# Altium project Beagle93.PrjPCB (part 3 of 5)

## Sheet FPGAPower&Misc.SchDoc: =ProjectName
size 420 x 297 mm; Author: G.K.; CompanyName: WUT; DrawnBy: P.K.; Organization: WUT ISE; Address1: Warsaw Univeristy of Technology; Address2: Nowowiejska 15/19; DocumentNumber: 5; Revision: 1.1; SheetNumber: 5; SheetTotal: 12; EDA_Number: ARTIQ; Projet: ARTIQ/SINARA; ModifiedBy: -; CreateDate: XX/XX/XXXX; CheckedDate: -; Title2: FPGAPower&Misc.SchDoc; DivGrp: ISE; Designer: G.K. and P.K.; ModifiedDate: -; ProjectName: ARTIQ/SINARA
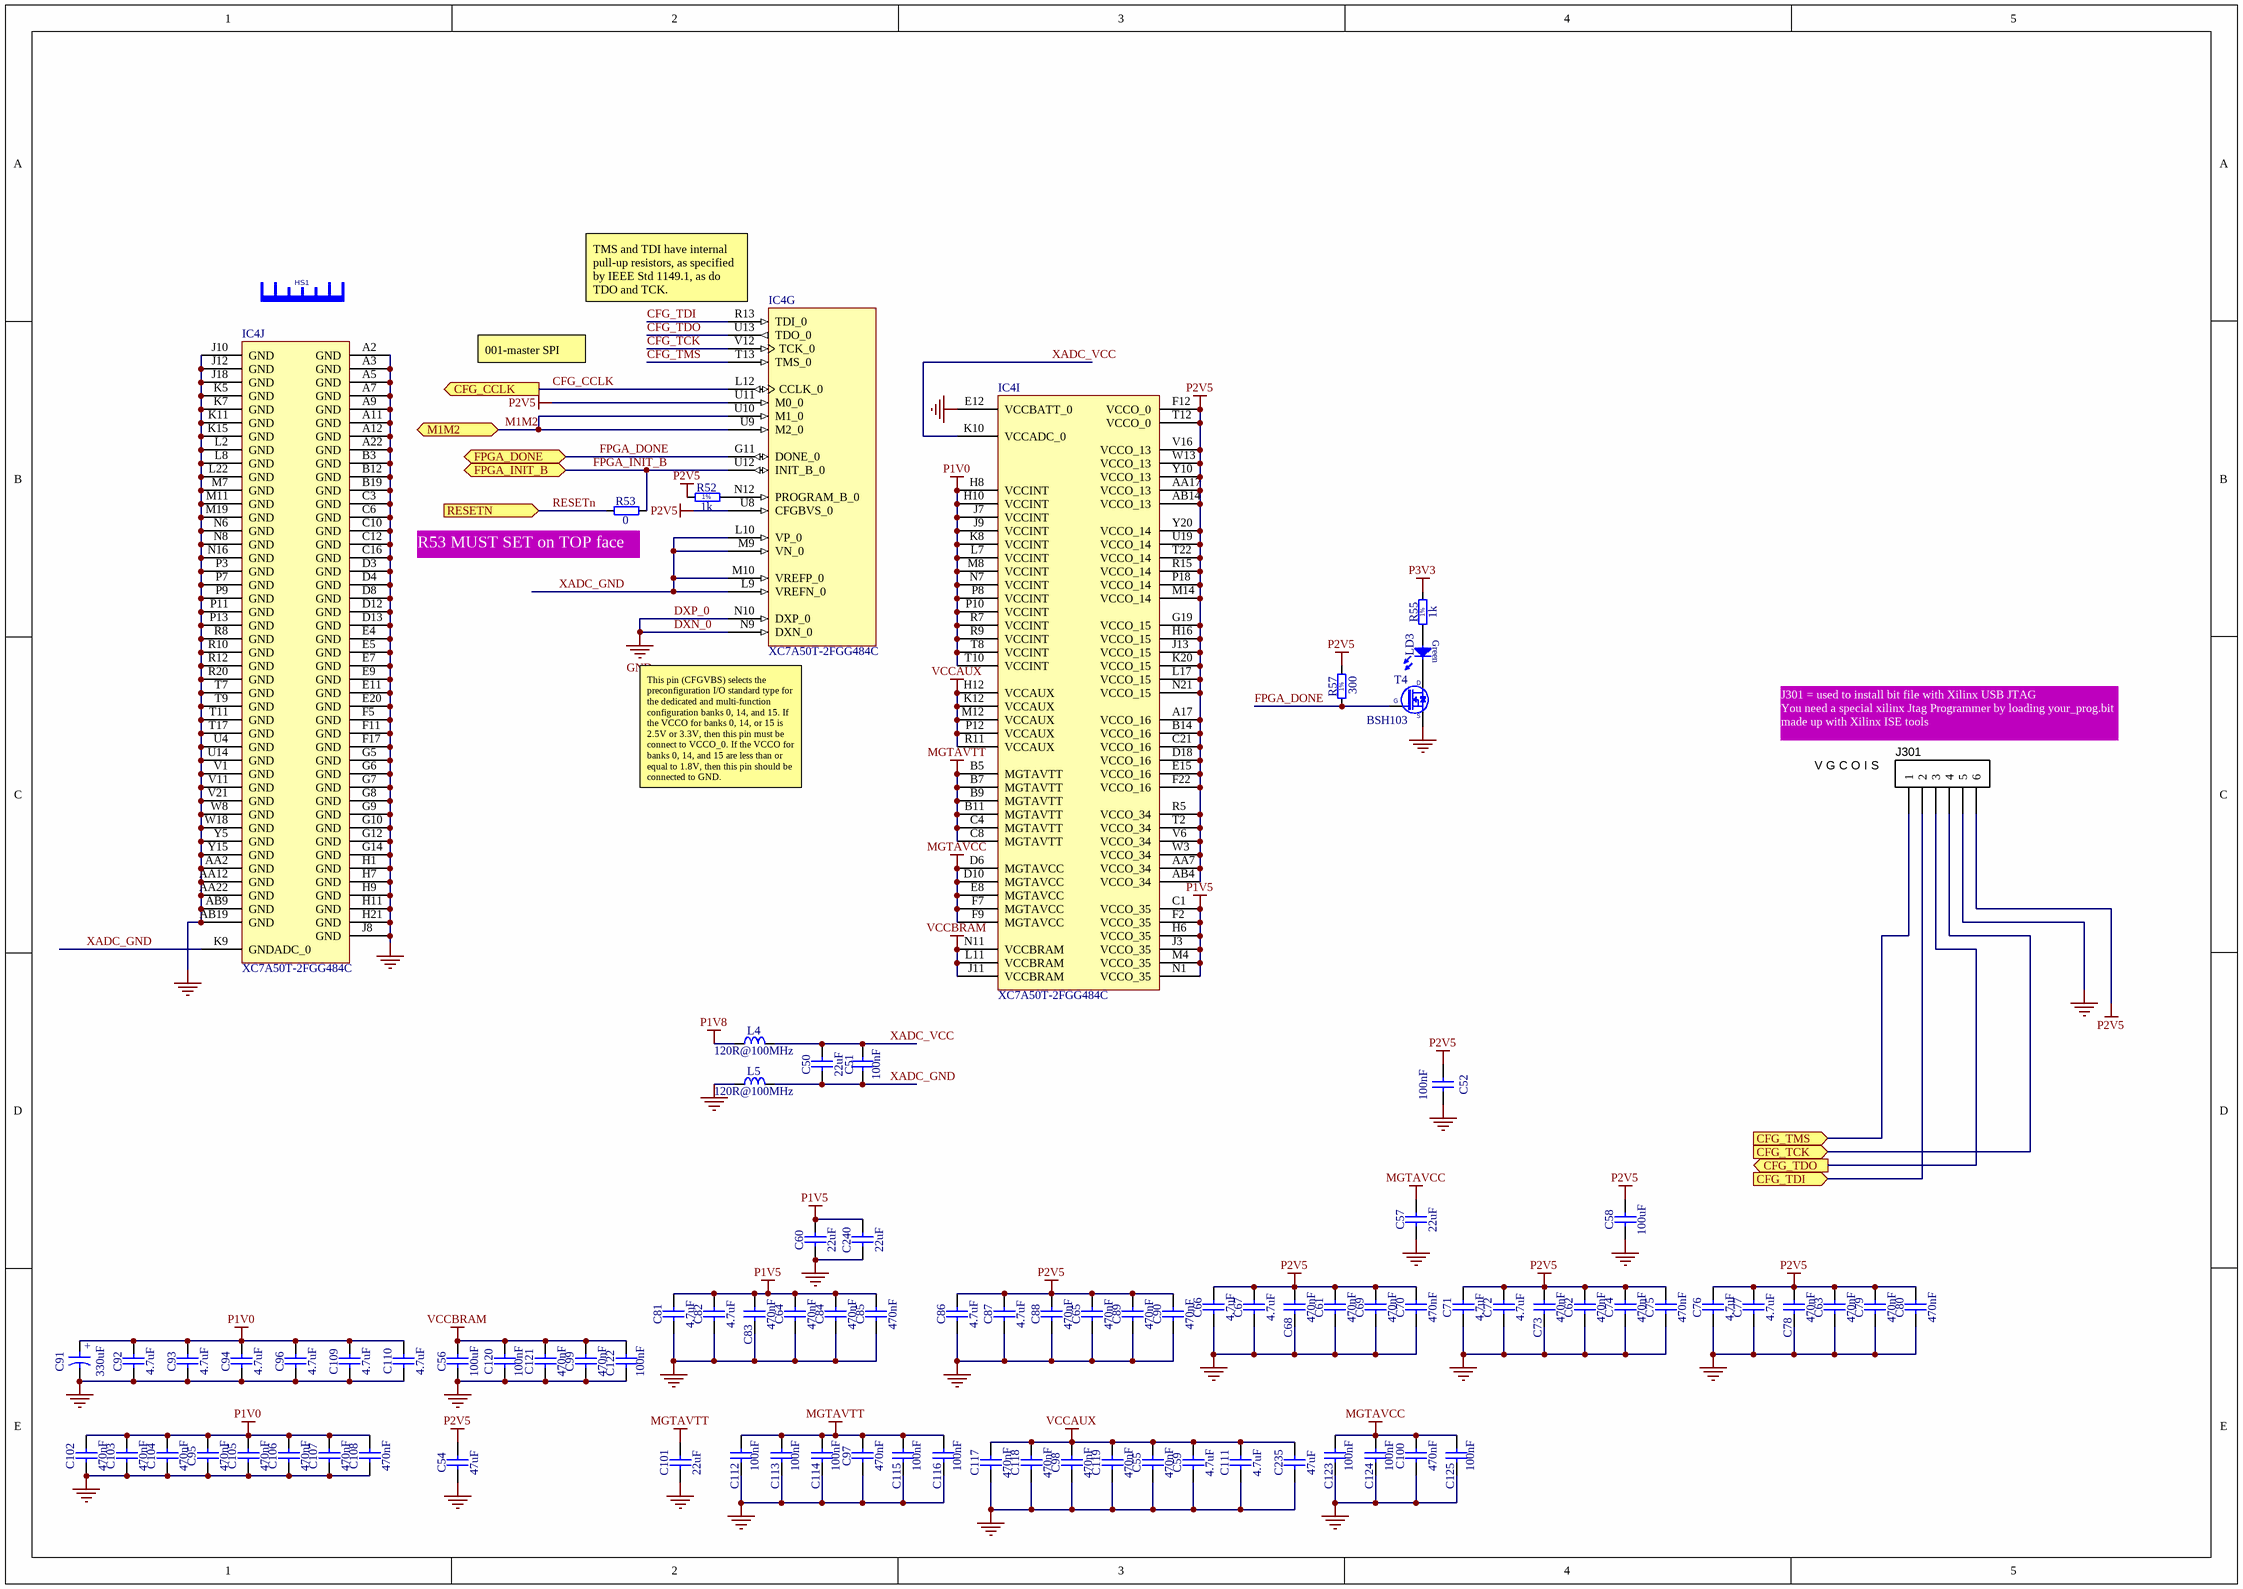
[diagram p3: FPGAPower&Misc.SchDoc]

### Parts
(Parts that share a designator on the sheet are numbered #1, #2 ... from top to bottom, then left to right.)
C50  22uF  [CAPC1709X100N]
C51  100nF  [CAPC0603X33N]
C52  100nF  [0603 Polar Cap]
C54  47uF  [CAPC3225X270N]
C55  470nF  [CAPC0603X33N]
C56  100uF  [CAPC3225X270N]
C57  22uF  [CAPC1709X100N]
C58  100uF  [CAPC3225X270N]
C59  4.7uF  [CAPC2012X135N]
C60  22uF  [CAPC1709X100N]
C61  470nF  [CAPC0603X33N]
C62  470nF  [CAPC0603X33N]
C63  470nF  [CAPC0603X33N]
C64  470nF  [CAPC0603X33N]
C65  470nF  [CAPC0603X33N]
C66  4.7uF  [CAPC2012X135N]
C67  4.7uF  [CAPC2012X135N]
C68  470nF  [CAPC0603X33N]
C69  470nF  [CAPC0603X33N]
C70  470nF  [CAPC0603X33N]
C71  4.7uF  [CAPC2012X135N]
C72  4.7uF  [CAPC2012X135N]
C73  470nF  [CAPC0603X33N]
C74  470nF  [CAPC0603X33N]
C75  470nF  [CAPC0603X33N]
C76  4.7uF  [CAPC2012X135N]
C77  4.7uF  [CAPC2012X135N]
C78  470nF  [CAPC0603X33N]
C79  470nF  [CAPC0603X33N]
C80  470nF  [CAPC0603X33N]
C81  4.7uF  [CAPC2012X135N]
C82  4.7uF  [CAPC2012X135N]
C83  470nF  [CAPC0603X33N]
C84  470nF  [CAPC0603X33N]
C85  470nF  [CAPC0603X33N]
C86  4.7uF  [CAPC2012X135N]
C87  4.7uF  [CAPC2012X135N]
C88  470nF  [CAPC0603X33N]
C89  470nF  [CAPC0603X33N]
C90  470nF  [CAPC0603X33N]
C91  330uF  [CAPMP7343X190N]
C92  4.7uF  [CAPC2012X135N]
C93  4.7uF  [CAPC2012X135N]
C94  4.7uF  [CAPC2012X135N]
C95  470nF  [CAPC0603X33N]
C96  4.7uF  [CAPC2012X135N]
C97  470nF  [CAPC0603X33N]
C98  470nF  [CAPC0603X33N]
C99  470nF  [CAPC0603X33N]
C100  470nF  [CAPC0603X33N]
C101  22uF  [CAPC1709X100N]
C102  470nF  [CAPC0603X33N]
C103  470nF  [CAPC0603X33N]
C104  470nF  [CAPC0603X33N]
C105  470nF  [CAPC0603X33N]
C106  470nF  [CAPC0603X33N]
C107  470nF  [CAPC0603X33N]
C108  470nF  [CAPC0603X33N]
C109  4.7uF  [CAPC2012X135N]
C110  4.7uF  [CAPC2012X135N]
C111  4.7uF  [CAPC2012X135N]
C112  100nF  [CAPC0603X33N]
C113  100nF  [CAPC0603X33N]
C114  100nF  [CAPC0603X33N]
C115  100nF  [CAPC0603X33N]
C116  100nF  [CAPC0603X33N]
C117  470nF  [CAPC0603X33N]
C118  470nF  [CAPC0603X33N]
C119  470nF  [CAPC0603X33N]
C120  100nF  [CAPC0603X33N]
C121  470nF  [CAPC0603X33N]
C122  100nF  [CAPC0603X33N]
C123  100nF  [CAPC0603X33N]
C124  100nF  [CAPC0603X33N]
C125  100nF  [CAPC0603X33N]
C235  47uF  [CAPC3225X270N]
C240  22uF  [CAPC1709X100N]
HS1  Heat Sink No Pad  [ICK BGA 23 x 23 x 10]  (value not drawn)
IC4#2  XC7A50T-2FGG484C  [FGG484]  (parts G,I,J of 10)
J301  V G C O I S  [HDR1X6]  (no BOM)
L4  120R@100MHz  [INDC1608X65N]
L5  120R@100MHz  [INDC1608X65N]
LD3  (no value)  [LED-0603-GREEN]
R52  1k  [RESC1005X40N]
R53  0  [RESC1005X40N]
R55  1k  [RESC1005X40N]
R57  300  [RESC1005X40N]
T4  BSH103  [SOT95P230X110-3N]

### Ports
CFG_CCLK (out), CFG_TCK (in), CFG_TDI (in), CFG_TDO (out), CFG_TMS (in), FPGA_DONE, FPGA_INIT_B, M1M2, RESETN (in)

### Nets
DXN_0: C52.1 C54.1 C55.1 C56.1 C57.1 C58.1 C59.1 C60.1 C61.1 C62.1 C63.1 C64.1 C65.1 C66.1 C67.1 C68.1 C69.1 C70.1 C71.1 C72.1 C73.1 C74.1 C75.1 C76.1 C77.1 C78.1 C79.1 C80.1 C81.1 C82.1 C83.1 C84.1 C85.1 C86.1 C87.1 C88.1 C89.1 C90.1 C91.2 C92.1 C93.1 C94.1 C95.1 C96.1 C97.1 C98.1 C99.1 C100.1 C101.1 C102.1 C103.1 C104.1 C105.1 C106.1 C107.1 C108.1 C109.1 C110.1 C111.1 C112.1 C113.1 C114.1 C115.1 C116.1 C117.1 C118.1 C119.1 C120.1 C121.1 C122.1 C123.1 C124.1 C125.1 C235.1 C240.1 IC4#2.A2(GND) IC4#2.A3(GND) IC4#2.A5(GND) IC4#2.A7(GND) IC4#2.A9(GND) IC4#2.A11(GND) IC4#2.A12(GND) IC4#2.A22(GND) IC4#2.AA2(GND) IC4#2.AA12(GND) IC4#2.AA22(GND) IC4#2.AB9(GND) IC4#2.AB19(GND) IC4#2.B3(GND) IC4#2.B12(GND) IC4#2.B19(GND) IC4#2.C3(GND) IC4#2.C6(GND) IC4#2.C10(GND) IC4#2.C12(GND) IC4#2.C16(GND) IC4#2.D3(GND) IC4#2.D4(GND) IC4#2.D8(GND) IC4#2.D12(GND) IC4#2.D13(GND) IC4#2.E4(GND) IC4#2.E5(GND) IC4#2.E7(GND) IC4#2.E9(GND) IC4#2.E11(GND) IC4#2.E12(VCCBATT_0) IC4#2.E20(GND) IC4#2.F5(GND) IC4#2.F11(GND) IC4#2.F17(GND) IC4#2.G5(GND) IC4#2.G6(GND) IC4#2.G7(GND) IC4#2.G8(GND) IC4#2.G9(GND) IC4#2.G10(GND) IC4#2.G12(GND) IC4#2.G14(GND) IC4#2.H1(GND) IC4#2.H7(GND) IC4#2.H9(GND) IC4#2.H11(GND) IC4#2.H21(GND) IC4#2.J8(GND) IC4#2.J10(GND) IC4#2.J12(GND) IC4#2.J18(GND) IC4#2.K5(GND) IC4#2.K7(GND) IC4#2.K11(GND) IC4#2.K15(GND) IC4#2.L2(GND) IC4#2.L8(GND) IC4#2.L22(GND) IC4#2.M7(GND) IC4#2.M11(GND) IC4#2.M19(GND) IC4#2.N6(GND) IC4#2.N8(GND) IC4#2.N9(DXN_0) IC4#2.N10(DXP_0) IC4#2.N16(GND) IC4#2.P3(GND) IC4#2.P7(GND) IC4#2.P9(GND) IC4#2.P11(GND) IC4#2.P13(GND) IC4#2.R8(GND) IC4#2.R10(GND) IC4#2.R12(GND) IC4#2.R20(GND) IC4#2.T7(GND) IC4#2.T9(GND) IC4#2.T11(GND) IC4#2.T17(GND) IC4#2.U4(GND) IC4#2.U14(GND) IC4#2.V1(GND) IC4#2.V11(GND) IC4#2.V21(GND) IC4#2.W8(GND) IC4#2.W18(GND) IC4#2.Y5(GND) IC4#2.Y15(GND) J301.5 L5.1 T4.2(S)  [also labelled DXP_0, GND]
MGTAVCC: C57.2 C100.2 C123.2 C124.2 C125.2 IC4#2.D6(MGTAVCC) IC4#2.D10(MGTAVCC) IC4#2.E8(MGTAVCC) IC4#2.F7(MGTAVCC) IC4#2.F9(MGTAVCC)
MGTAVTT: C97.2 C101.2 C112.2 C113.2 C114.2 C115.2 C116.2 IC4#2.B5(MGTAVTT) IC4#2.B7(MGTAVTT) IC4#2.B9(MGTAVTT) IC4#2.B11(MGTAVTT) IC4#2.C4(MGTAVTT) IC4#2.C8(MGTAVTT)
P1V0: C91.1 C92.2 C93.2 C94.2 C95.2 C96.2 C102.2 C103.2 C104.2 C105.2 C106.2 C107.2 C108.2 C109.2 C110.2 IC4#2.H8(VCCINT) IC4#2.H10(VCCINT) IC4#2.J7(VCCINT) IC4#2.J9(VCCINT) IC4#2.K8(VCCINT) IC4#2.L7(VCCINT) IC4#2.M8(VCCINT) IC4#2.N7(VCCINT) IC4#2.P8(VCCINT) IC4#2.P10(VCCINT) IC4#2.R7(VCCINT) IC4#2.R9(VCCINT) IC4#2.T8(VCCINT) IC4#2.T10(VCCINT)
P1V5: C60.2 C64.2 C81.2 C82.2 C83.2 C84.2 C85.2 C240.2 IC4#2.C1(VCCO_35) IC4#2.F2(VCCO_35) IC4#2.H6(VCCO_35) IC4#2.J3(VCCO_35) IC4#2.M4(VCCO_35) IC4#2.N1(VCCO_35)
P1V8: L4.1
P2V5: C52.2 C54.2 C58.2 C61.2 C62.2 C63.2 C65.2 C66.2 C67.2 C68.2 C69.2 C70.2 C71.2 C72.2 C73.2 C74.2 C75.2 C76.2 C77.2 C78.2 C79.2 C80.2 C86.2 C87.2 C88.2 C89.2 C90.2 IC4#2.A17(VCCO_16) IC4#2.AA7(VCCO_34) IC4#2.AA17(VCCO_13) IC4#2.AB4(VCCO_34) IC4#2.AB14(VCCO_13) IC4#2.B14(VCCO_16) IC4#2.C21(VCCO_16) IC4#2.D18(VCCO_16) IC4#2.E15(VCCO_16) IC4#2.F12(VCCO_0) IC4#2.F22(VCCO_16) IC4#2.G19(VCCO_15) IC4#2.H16(VCCO_15) IC4#2.J13(VCCO_15) IC4#2.K20(VCCO_15) IC4#2.L17(VCCO_15) IC4#2.M14(VCCO_14) IC4#2.N21(VCCO_15) IC4#2.P18(VCCO_14) IC4#2.R5(VCCO_34) IC4#2.R15(VCCO_14) IC4#2.T2(VCCO_34) IC4#2.T12(VCCO_0) IC4#2.T22(VCCO_14) IC4#2.U8(CFGBVS_0) IC4#2.U11(M0_0) IC4#2.U19(VCCO_14) IC4#2.V6(VCCO_34) IC4#2.V16(VCCO_13) IC4#2.W3(VCCO_34) IC4#2.W13(VCCO_13) IC4#2.Y10(VCCO_13) IC4#2.Y20(VCCO_14) J301.6 R52.1 R57.2
P3V3: R55.2  [project net VCC]
VCCAUX: C55.2 C59.2 C98.2 C111.2 C117.2 C118.2 C119.2 C235.2 IC4#2.H12(VCCAUX) IC4#2.K12(VCCAUX) IC4#2.M12(VCCAUX) IC4#2.P12(VCCAUX) IC4#2.R11(VCCAUX)
VCCBRAM: C56.2 C99.2 C120.2 C121.2 C122.2 IC4#2.J11(VCCBRAM) IC4#2.L11(VCCBRAM) IC4#2.N11(VCCBRAM)
CFG_CCLK: IC4#2.L12(CCLK_0) ; port CFG_CCLK
CFG_TCK: IC4#2.V12(TCK_0)
CFG_TDI: IC4#2.R13(TDI_0)
CFG_TDO: IC4#2.U13(TDO_0)
CFG_TMS: IC4#2.T13(TMS_0)
FPGA_DONE: IC4#2.G11(DONE_0) R57.1 T4.1(G) ; port FPGA_DONE
FPGA_INIT_B: IC4#2.U12(INIT_B_0) R53.2 ; port FPGA_INIT_B
M1M2: IC4#2.U9(M2_0) IC4#2.U10(M1_0) ; port M1M2
RESETn: R53.1 ; port RESETN
XADC_GND: C50.1 C51.1 IC4#2.K9(GNDADC_0) IC4#2.L9(VREFN_0) IC4#2.L10(VP_0) IC4#2.M9(VN_0) IC4#2.M10(VREFP_0) L5.2
XADC_VCC: C50.2 C51.2 IC4#2.K10(VCCADC_0) L4.2
NetIC4#2_N12: IC4#2.N12(PROGRAM_B_0) R52.2
NetJ301_1: J301.1 ; port CFG_TMS
NetJ301_2: J301.2 ; port CFG_TDI
NetJ301_3: J301.3 ; port CFG_TDO
NetJ301_4: J301.4 ; port CFG_TCK
NetLD3_1: LD3.1(A) R55.1
NetLD3_2: LD3.2(C) T4.3(D)

### Notes on the sheet
- (near IC4#2) TMS and TDI have internal pull-up resistors, as specified by IEEE Std 1149.1, as do TDO and TCK.
- 001-master SPI
- (near R53) R53 MUST SET on TOP face
- (near IC4#2) This pin (CFGVBS) selects the preconfiguration I/O standard type for the dedicated and multi-function configuration banks 0, 14, and 15. If the VCCO for banks 0, 14, or 15 is 2.5V or 3.3V, then this pin must be connect to VCCO_0. If the VCCO for banks 0, 14, and 15 are less than or equal to 1.8V, then this pin should be connected to GND.
- (near J301) J301 = used to install bit file with Xilinx USB JTAG
  You need a special xilinx Jtag Programmer by loading your_prog.bit
  made up with Xilinx ISE tools
- (in symbol CTE7343-19_330UF_2.5V_20%_LESR0025_KEMET_T520) +
- (in symbol KINGBRIGHT_KPTR-3216CGCK) Green
- (in symbol R0402_1K_1%_0.0625W_100PPM) 1%
- (in symbol R0402_1k_1%_0.0625W_100PPM) 1%
- (in symbol R0402_300R_1%_0.0625W_100PPM) 1%

### Library data of the parts
C50 C57 C60 C101 C240 = CC0603_22UF_6.3V_20%_X5R: Non-polarised capacitor; Part Description: SMD Multilayer Chip Ceramic Capacitor; Manufacturer: GENERIC; Manufacturer1 Part Number: C1608X5R0J226M080AC; Voltage: 6.3V; TC: X5R; Tolerance: ±20%; Part Number: CC0603_22UF_6.3V_20%_X5R; Component Kind: Standard; Component Type: Standard; Pin Count: 2; Value: 22uF; Status: None; Manufacturer Part Number: CC0603_22UF_6.3V_20%_X5R; Case: 0603; Mounted: Yes; Socket: No; SMD: Yes; Sense: No; Manufacturer1 Example: TDK; Manufacturer1 ComponentHeight: 1mm; HelpURL: \\cern.ch\dfs\Applications\Altium\Datasheets\CC0603_X5R_TDK_C.pdf; Author: CERN DEM JLC; CreateDate: 16.12.2013; LatestRevisionDate: 13.09.2016; ClassName: Artix
C51 C52 C112-C116 C120 C122-C125 = CC0201_100NF_6.3V_10%_X5R: Non-polarised capacitor; Part Description: SMD Multilayer Chip Ceramic Capacitor; Manufacturer: GENERIC; Manufacturer1 Part Number: 02016D104KAT2A; Voltage: 6.3V; TC: X5R; Tolerance: ±10%; Part Number: CC0201_100NF_6.3V_10%_X5R; Component Kind: Standard; Component Type: Standard; Pin Count: 2; Value: 100nF; Status: Not Recommended; Manufacturer Part Number: CC0201_100NF_6.3V_10%_X5R; Case: 0201; Mounted: Yes; Socket: No; SMD: Yes; Sense: No; Manufacturer1 Example: AVX; Manufacturer1 ComponentHeight: 0.33mm; HelpURL: \\cern.ch\dfs\Applications\Altium\Datasheets\CC0201_X5R_AVX.pdf; Author: CERN DEM JLC; CreateDate: 2007-12-03; LatestRevisionDate: 2007-12-03
  C51 C112-C116 C120 C122-C125: ClassName: Artix
  C52: Footprint: CAPC0603X33N; ClassName: FPGA_JTAG
C54 C235 = CC1210_47UF_10V_10%_X7R: Non-polarised capacitor; Part Description: SMD Multilayer Chip Ceramic Capacitor; Manufacturer: GENERIC; Manufacturer1 Part Number: GRM32ER71A476KE15; Voltage: 10V; TC: X7R; Tolerance: ±10%; Part Number: CC1210_47UF_10V_10%_X7R; Component Kind: Standard; Component Type: Standard; Pin Count: 2; Value: 47uF; Status: None; Manufacturer Part Number: CC1210_47UF_10V_10%_X7R; Case: 1210; Mounted: Yes; Socket: No; SMD: Yes; Sense: No; Manufacturer1 Example: MURATA; Manufacturer1 ComponentHeight: 2.7mm; HelpURL: \\cern.ch\dfs\Applications\Altium\Datasheets\CC1210_X7R_MURATA.pdf; Author: CERN DEM BC; CreateDate: 18.11.2015; LatestRevisionDate: 18.11.2015
C55 C61-C65 C68-C70 C73-C75 C78-C80 C83-C85 C88-C90 C95 C97-C100 C102-C108 C117-C119 C121 = CC0201_470NF_4V_20%_X5R: Non-polarised capacitor; Part Description: SMD Multilayer Chip Ceramic Capacitor; Manufacturer: GENERIC; Manufacturer1 Part Number: AMK063BJ474MP-F; Voltage: 4V; TC: X5R; Tolerance: ±20%; Part Number: CC0201_470NF_4V_20%_X5R; Component Kind: Standard; Component Type: Standard; Pin Count: 2; Value: 470nF; Status: Not Recommended; Manufacturer Part Number: CC0201_470NF_4V_20%_X5R; Case: 0201; Mounted: Yes; Socket: No; SMD: Yes; Sense: No; Manufacturer1 Example: TAIYO YUDEN; Manufacturer1 ComponentHeight: 0.33mm; HelpURL: \\cern.ch\dfs\Applications\Altium\Datasheets\CC0201_X5R_TAIYO-YUDEN_STANDARD-CLASS2.pdf; Author: CERN DEM JLC; CreateDate: 27.05.2010; LatestRevisionDate: 27.05.2010
  C61-C65 C95 C97-C100: ClassName: Artix
C56 C58 = CC1210_100UF_6.3V_20%_X5R: Non-polarised capacitor; Part Description: SMD Multilayer Chip Ceramic Capacitor; Manufacturer: GENERIC; Manufacturer1 Part Number: GRM32ER60J107ME20L; Voltage: 6.3V; TC: X5R; Tolerance: ±20%; Part Number: CC1210_100UF_6.3V_20%_X5R; Component Kind: Standard; Component Type: Standard; Pin Count: 2; Value: 100uF; Status: Preferred; Manufacturer Part Number: CC1210_100UF_6.3V_20%_X5R; Case: 1210; Mounted: Yes; Socket: No; SMD: Yes; Sense: No; Manufacturer1 Example: MURATA; Manufacturer1 ComponentHeight: 2.7mm; HelpURL: \\cern.ch\dfs\Applications\Altium\Datasheets\CC1210_X5R_MURATA.pdf; Author: CERN DEM JLC; CreateDate: 19.04.2010; LatestRevisionDate: 19.04.2010
C59 C66 C67 C71 C72 C76 C77 C81 C82 C86 C87 C92-C94 C96 C109-C111 = CC0805_4.7UF_10V_10%_X5R: Non-polarised capacitor; Manufacturer: GENERIC; Part Description: SMD Multilayer Chip Ceramic Capacitor; Manufacturer1 Part Number: 222224013672; Voltage: 10V; TC: X5R; Tolerance: ±10%; Part Number: CC0805_4.7UF_10V_10%_X5R; Component Kind: Standard; Component Type: Standard; Pin Count: 2; Value: 4.7uF; Status: Preferred; Manufacturer Part Number: CC0805_4.7UF_10V_10%_X5R; Case: 0805; Mounted: Yes; Socket: No; SMD: Yes; Sense: No; Manufacturer1 Example: PHYCOMP; Manufacturer1 ComponentHeight: 1.45mm; HelpURL: \\cern.ch\dfs\Applications\Altium\Datasheets\CC0805_X5R_PHYCOMP_HC.pdf; Author: CERN DEM JLC; CreateDate: 03.12.2007; LatestRevisionDate: 03.12.2007
C91 = CTE7343-19_330UF_2.5V_20%_LESR0025_KEMET_T520: Polarised capacitor; Part Description: Low ESR 0R025 Tantalum Chip Capacitor; Manufacturer: KEMET; Manufacturer Part Number: T520V337M2R5ATE025; Voltage: 2.5V; Tolerance: ±20%; Part Number: CTE7343-19_330UF_2.5V_20%_LESR0025_KEMET_T520; Component Kind: Standard; Component Type: Standard; Pin Count: 2; Value: 330uF; Status: None; Case: V; Mounted: Yes; Socket: No; SMD: Yes; Sense: No; ComponentHeight: 1.9mm; HelpURL: \\cern.ch\dfs\Applications\Altium\Datasheets\CTE-LESR_KEMET_T520.pdf; Author: CERN DEM MR; CreateDate: 23.03.2016; LatestRevisionDate: 23.03.2016
HS1 = Heat Sink No Pad: Heat Sink Without Pad; Manufacturer: Fischer Elektronik; Part Description: 23 x 23 x 10 mm, heatsink for IC design BGA and others; Manufacturer Part Number: ICK BGA 23 x 23 x 10; ComponentHeight: 10 mm; HelpURL: http://www.fischerelektronik.de/web_fischer/en_GB/heatsinks/B02/Heatsinks%20for%20BGAs/PR/ICKBGA23x23x10_/$productCard/parameters/datasheet.xhtml
IC4#2 = CMP-0364-00026-3: Artix-7 FPGA, 285 User I/Os, 4 GTP, 484-Ball BGA, Speed Grade 2, Commercial Grade, Pb-Free; Generic Part Number: XC7A100T; Manufacturer: Xilinx; Max User I/O: 300; Clock Mgmt Tiles (CMTs): 6; Logic Cells: 101440; Block RAM Blocks (36Kb): 135; Block RAM Blocks (18Kb): 270; Speed Grade: -2; CLBs (Slices): 15850; Block RAM Blocks (Max Kb): 4860; DSP48E1 Slices: 240; RoHS: Pb-Free; ComponentLink3URL: http://www.xilinx.com/support/documentation/data_sheets/ds181_Artix_7_Data_Sheet.pdf; NexusDeviceID: XC7A100T-2FGG484C; DatasheetVersion: v1.12; Mounting Technology: Surface Mount; PackageDescription: Wire-Bond Fine-Pitch BGA, Body 23 x 23 mm, 1.0 mm Pitch; PackageReference: FGG484; ComponentLink2Description: Package Specification; Code_JEDEC: MS-034-AAJ-1; ComponentLink2URL: http://www.xilinx.com/support/documentation/user_guides/ug475_7Series_Pkg_Pinout.pdf; ComponentLink3Description: DC and Switching Characteristics; ComponentLink4Description: Package File; ComponentLink4URL: http://www.xilinx.com/support/packagefiles/a7packages/xc7a100tfgg484pkg.txt; ComponentLink1URL: http://www.xilinx.com/support/documentation/data_sheets/ds180_7Series_Overview.pdf; PartNumber: XC7A100T-2FGG484C; ComponentLink5URL: http://www.xilinx.com/support/documentation/user_guides/ug475_7Series_Pkg_Pinout.pdf; PackageVersion: Rev 1.8; ComponentLink5Description: Packaging and Pinout; ComponentLink1Description: Datasheet; CLBs (Max Distributed RAM Kb): 1188; ClassName: Artix
J301 = Header6P: Header, 6-pin, FPGA_JTAG
L4 L5 = IND0603_MURATA_BLM18SG121TN1D: Inductor; Part Description: SMD EMIFIL Suppression Chip Ferrite Bead; Manufacturer: MURATA; Power: 3A; Resistance: 0.025R; Tolerance: ±25%; Part Number: IND0603_MURATA_BLM18SG121TN1D; Component Kind: Standard; Component Type: Standard; Pin Count: 2; Value: 120R@100MHz; Status: None; Manufacturer Part Number: BLM18SG121TN1D; Case: 0603; Mounted: Yes; Socket: No; SMD: Yes; Sense: No; ComponentHeight: 0.65mm; HelpURL: \\cern.ch\dfs\Applications\Altium\Datasheets\IND0603_MURATA_BLM18S.pdf; Author: CERN DEM JLC; CreateDate: 23.07.2014; LatestRevisionDate: 23.07.2014; ClassName: Artix
LD3 = KINGBRIGHT_KPTR-3216CGCK: LED Green 1A 2C; Manufacturer Part Number: KPH-1608CGCK; ComponentHeight: 0.65mm; HelpURL: http://datasheet.octopart.com/KPH-1608CGCK-Kingbright-datasheet-62316526.pdf; Package Description: SMT Green LED, Case 0603, Body L 1.6 x W 0.8mm H 0.65mm
R52 = R0402_1K_1%_0.0625W_100PPM: Resistor - 1%; Part Description: General Purpose Thick Film Chip Resistor; Manufacturer: GENERIC; Manufacturer1 Part Number: 232270671002L; TC: ±100ppm/°C; PressFit: No; Part Number: R0402_1K_1%_0.0625W_100PPM; Component Kind: Standard; Component Type: Standard; Pin Count: 2; Value: 1k; Status: Not Recommended; Power: 0.0625W; Tolerance: ±1%; Manufacturer Part Number: R0402_1K_1%_0.0625W_100PPM; Case: 0402; Mounted: Yes; Sense: No; Socket: No; SMD: Yes; Manufacturer1 Example: YAGEO PHYCOMP; Manufacturer1 ComponentHeight: 0.4mm; HelpURL: \\cern.ch\dfs\Applications\Altium\Datasheets\R0402_Phycomp_RC0402.pdf; Author: CERN DEM JLC; CreateDate: 03.12.2007; LatestRevisionDate: 17.10.2012; ClassName: Artix
R53 = R0402_0R_JUMPER: Resistor; Part Description: 1A (0.05R Max DC Resistance) Zero Ohm Jumper; Manufacturer: GENERIC; Manufacturer1 Part Number: 232270591001L; PressFit: No; Part Number: R0402_0R_JUMPER; Component Kind: Standard; Component Type: Standard; Pin Count: 2; Value: 0; Status: Not Recommended; Manufacturer Part Number: R0402_0R_JUMPER; Case: 0402; Mounted: Yes; Sense: No; Socket: No; SMD: Yes; Manufacturer1 Example: YAGEO PHYCOMP; Manufacturer1 ComponentHeight: 0.4mm; HelpURL: \\cern.ch\dfs\Applications\Altium\Datasheets\R0402_Phycomp_RC0402.pdf; Author: CERN DEM JLC; CreateDate: 03.12.2007; LatestRevisionDate: 17.10.2012; ClassName: Artix
R55 = R0402_1k_1%_0.0625W_100PPM: Resistor - 1%; Part Description: General Purpose Thick Film Chip Resistor; Manufacturer: GENERIC; Manufacturer1 Part Number: 232270671002L; TC: ±100ppm/°C; PressFit: No; Part Number: R0402_1K_1%_0.0625W_100PPM; Component Kind: Standard; Component Type: Standard; Pin Count: 2; Value: 1k; Status: Not Recommended; Power: 0.0625W; Tolerance: ±1%; Manufacturer Part Number: R0402_1K_1%_0.0625W_100PPM; Case: 0402; Mounted: Yes; Sense: No; Socket: No; SMD: Yes; Manufacturer1 Example: YAGEO PHYCOMP; Manufacturer1 ComponentHeight: 0.4mm; HelpURL: \\cern.ch\dfs\Applications\Altium\Datasheets\R0402_Phycomp_RC0402.pdf; Author: CERN DEM JLC; CreateDate: 03.12.2007; LatestRevisionDate: 17.10.2012; ClassName: Artix
R57 = R0402_300R_1%_0.0625W_100PPM: Resistor - 1%; Part Description: General Purpose Thick Film Chip Resistor; Manufacturer: GENERIC; Manufacturer1 Part Number: 232270673001L; TC: ±100ppm/°C; PressFit: No; Part Number: R0402_300R_1%_0.0625W_100PPM; Component Kind: Standard; Component Type: Standard; Pin Count: 2; Value: 300; Status: Not Recommended; Power: 0.0625W; Tolerance: ±1%; Manufacturer Part Number: R0402_300R_1%_0.0625W_100PPM; Case: 0402; Mounted: Yes; Sense: No; Socket: No; SMD: Yes; Manufacturer1 Example: YAGEO PHYCOMP; Manufacturer1 ComponentHeight: 0.4mm; HelpURL: \\cern.ch\dfs\Applications\Altium\Datasheets\R0402_Phycomp_RC0402.pdf; Author: CERN DEM JLC; CreateDate: 03.12.2007; LatestRevisionDate: 17.10.2012
T4 = BSH103: N-CHANNEL MOSFET WITH DIODE; Part Description: 30V 850mA N-Channel Enhancement Mode Field-Effect Transistor; Manufacturer: NEXPERIA; PressFit: No; Bonding: No; Part Number: BSH103; Component Kind: Standard; Component Type: Standard; Device: BSH103; PackageDescription: SOT23, 3 pin, Pitch 0.95mm - 1.3mm W X 2.9mm L X 1.1mm H, IPC Medium Density; Manufacturer Part Number: BSH103; Pin Count: 3; Case: SOT23-3; Mounted: Yes; Socket: No; SMD: Yes; Sense: No; ComponentHeight: 1.1mm; HelpURL: \\cern.ch\dfs\Applications\Altium\Datasheets\BSH103.pdf; Author: CERN DEM JLC; CreateDate: 16.03.2010; LatestRevisionDate: 20.06.2017; ClassName: Artix

## Sheet FPGA_SDRAM.SchDoc: =ProjectName
size 420 x 297 mm; Author: G.K.; CompanyName: WUT; DrawnBy: G.K. and P.K.; Organization: WUT ISE; Address1: Warsaw Univeristy of Technology; Address2: Nowowiejska 15/19; DocumentNumber: 8; Revision: 1.1; SheetNumber: 8; SheetTotal: 12; EDA_Number: ARTIQ; Projet: ARTIQ/SINARA; ModifiedBy: -; CreateDate: XX/XX/XXXX; CheckedDate: -; Title2: FPGA_SDRAM.SchDoc; DivGrp: ISE; Designer: G.K. and P.K.; ModifiedDate: -; ProjectName: ARTIQ/SINARA
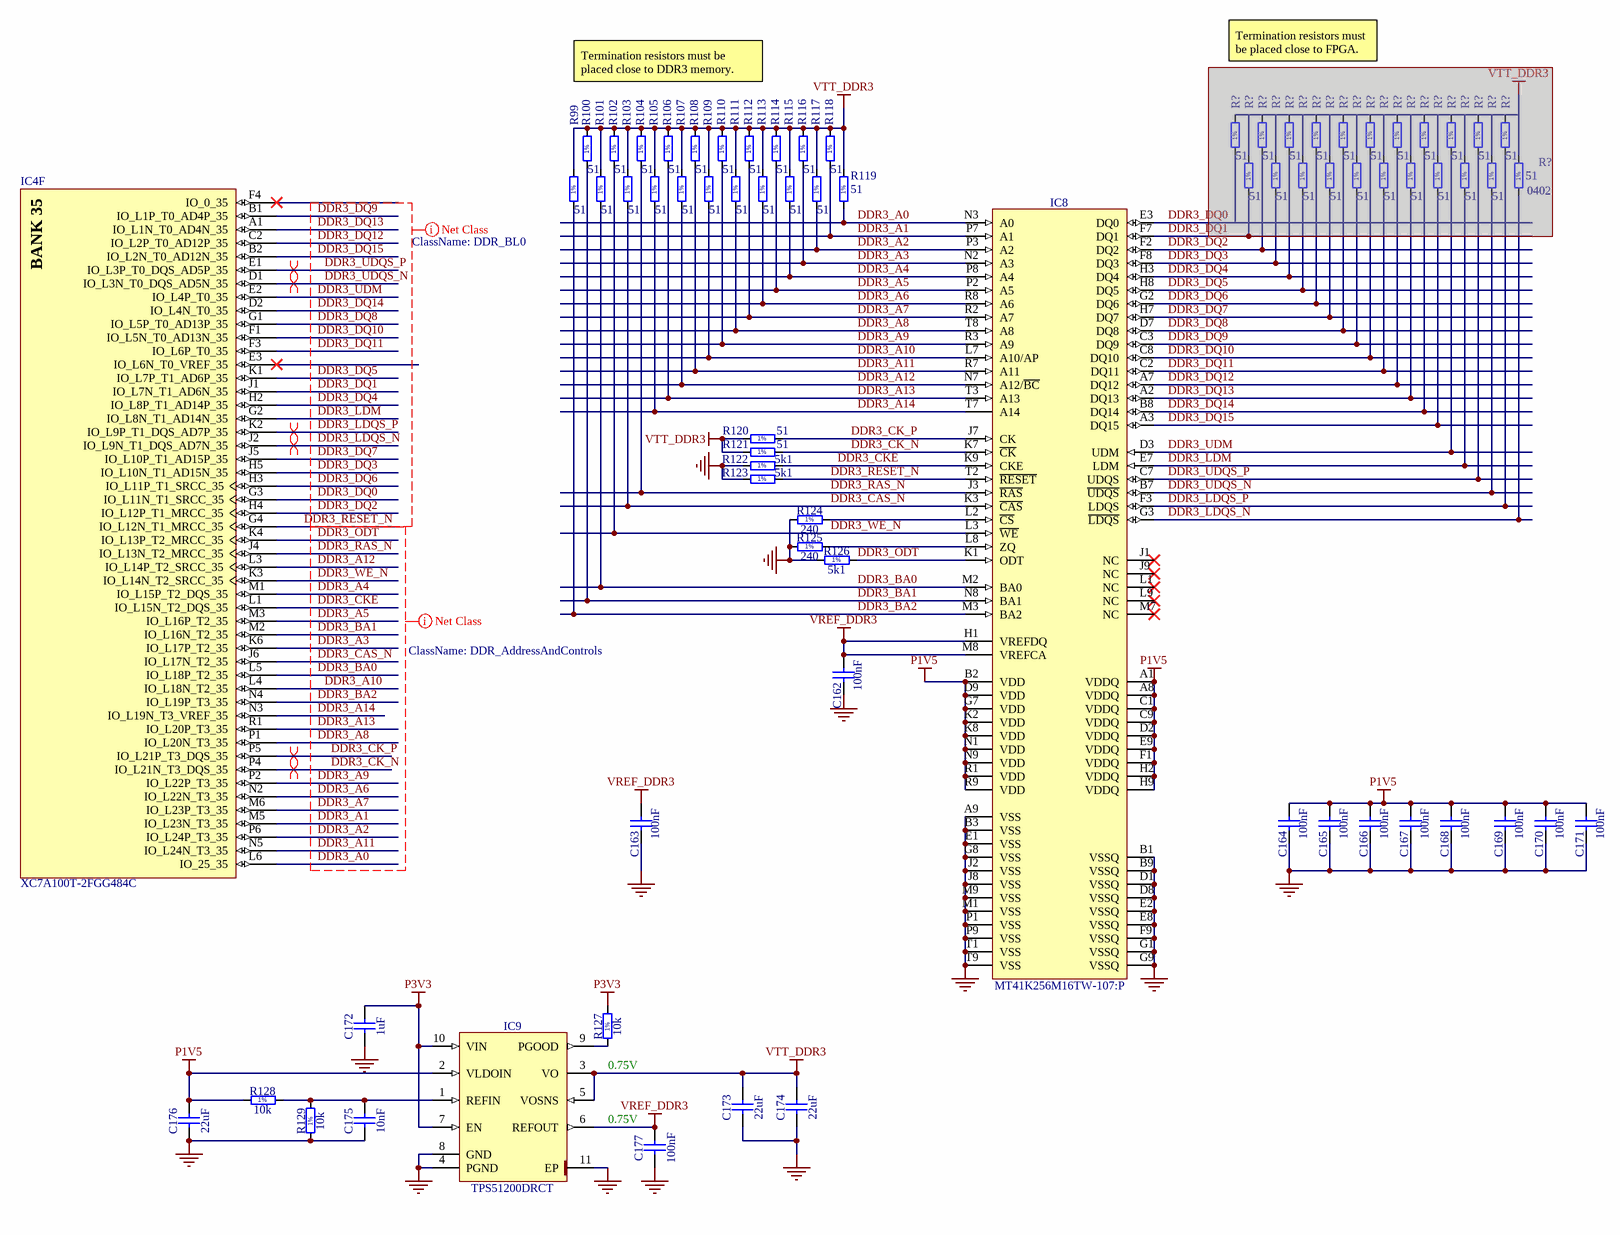
[diagram p4: FPGA_SDRAM.SchDoc]

### Parts
(Parts that share a designator on the sheet are numbered #1, #2 ... from top to bottom, then left to right.)
C162  100nF  [CAPC0603X33N]
C163  100nF  [CAPC0603X33N]
C164  100nF  [CAPC0603X33N]
C165  100nF  [CAPC0603X33N]
C166  100nF  [CAPC0603X33N]
C167  100nF  [CAPC0603X33N]
C168  100nF  [CAPC0603X33N]
C169  100nF  [CAPC0603X33N]
C170  100nF  [CAPC0603X33N]
C171  100nF  [CAPC0603X33N]
C172  1uF  [CAPC1005X55N]
C173  22uF  [CAPC1709X100N]
C174  22uF  [CAPC1709X100N]
C175  10nF  [CAPC1005X55N]
C176  22uF  [CAPC1709X100N]
C177  100nF  [CAPC0603X33N]
IC4#2  XC7A100T-2FGG484C  [FGG484]  (part F of 10)
IC8  MT41K256M16TW-107:P  [BGA96C80P9X16_800X1400X120]
IC9  TPS51200DRCT  [TEXAS_DRC (S-PVSON-N10)]
R99  51  [RESC1005X40N]
R100  51  [RESC1005X40N]
R101  51  [RESC1005X40N]
R102  51  [RESC1005X40N]
R103  51  [RESC1005X40N]
R104  51  [RESC1005X40N]
R105  51  [RESC1005X40N]
R106  51  [RESC1005X40N]
R107  51  [RESC1005X40N]
R108  51  [RESC1005X40N]
R109  51  [RESC1005X40N]
R110  51  [RESC1005X40N]
R111  51  [RESC1005X40N]
R112  51  [RESC1005X40N]
R113  51  [RESC1005X40N]
R114  51  [RESC1005X40N]
R115  51  [RESC1005X40N]
R116  51  [RESC1005X40N]
R117  51  [RESC1005X40N]
R118  51  [RESC1005X40N]
R119  51  [RESC1005X40N]
R120  51  [RESC1005X40N]
R121  51  [RESC1005X40N]
R122  5k1  [RESC1005X40N]
R123  5k1  [RESC1005X40N]
R124  240  [RESC1005X40N]
R125  240  [RESC1005X40N]
R126  5k1  [RESC1005X40N]
R127  10k  [RESC1005X40N]
R128  10k  [RESC1005X40N]
R129  10k  [RESC1005X40N]
R?#1  51  [RESC1005X40N]  (masked out: inside a compile mask, not in the netlist)
R?#2  51  [RESC1005X40N]  (masked out: inside a compile mask, not in the netlist)
R?#3  51  [RESC1005X40N]  (masked out: inside a compile mask, not in the netlist)
R?#4  51  [RESC1005X40N]  (masked out: inside a compile mask, not in the netlist)
R?#5  51  [RESC1005X40N]  (masked out: inside a compile mask, not in the netlist)
R?#6  51  [RESC1005X40N]  (masked out: inside a compile mask, not in the netlist)
R?#7  51  [RESC1005X40N]  (masked out: inside a compile mask, not in the netlist)
R?#8  51  [RESC1005X40N]  (masked out: inside a compile mask, not in the netlist)
R?#9  51  [RESC1005X40N]  (masked out: inside a compile mask, not in the netlist)
R?#10  51  [RESC1005X40N]  (masked out: inside a compile mask, not in the netlist)
R?#11  51  [RESC1005X40N]  (masked out: inside a compile mask, not in the netlist)
R?#12  51  [RESC1005X40N]  (masked out: inside a compile mask, not in the netlist)
R?#13  51  [RESC1005X40N]  (masked out: inside a compile mask, not in the netlist)
R?#14  51  [RESC1005X40N]  (masked out: inside a compile mask, not in the netlist)
R?#15  51  [RESC1005X40N]  (masked out: inside a compile mask, not in the netlist)
R?#16  51  [RESC1005X40N]  (masked out: inside a compile mask, not in the netlist)
R?#17  51  [RESC1005X40N]  (masked out: inside a compile mask, not in the netlist)
R?#18  51  [RESC1005X40N]  (masked out: inside a compile mask, not in the netlist)
R?#19  51  [RESC1005X40N]  (masked out: inside a compile mask, not in the netlist)
R?#20  51  [RESC1005X40N]  (masked out: inside a compile mask, not in the netlist)
R?#21  51  [RESC1005X40N]  (masked out: inside a compile mask, not in the netlist)
R?#22  51  Case: 0402  [RESC1005X40N]  (masked out: inside a compile mask, not in the netlist)

### Nets
GND: C162.1 C163.1 C164.1 C165.1 C166.1 C167.1 C168.1 C169.1 C170.1 C171.1 C172.1 C173.1 C174.1 C175.1 C176.1 C177.1 IC8.A9(VSS) IC8.B1(VSSQ) IC8.B3(VSS) IC8.B9(VSSQ) IC8.D1(VSSQ) IC8.D8(VSSQ) IC8.E1(VSS) IC8.E2(VSSQ) IC8.E8(VSSQ) IC8.F9(VSSQ) IC8.G1(VSSQ) IC8.G8(VSS) IC8.G9(VSSQ) IC8.J2(VSS) IC8.J8(VSS) IC8.M1(VSS) IC8.M9(VSS) IC8.P1(VSS) IC8.P9(VSS) IC8.T1(VSS) IC8.T9(VSS) IC9.4(PGND) IC9.8(GND) IC9.11(EP) R122.1 R123.1 R124.1 R125.1 R126.1 R129.1  [project net DXN_0]
P1V5: C164.2 C165.2 C166.2 C167.2 C168.2 C169.2 C170.2 C171.2 C176.2 IC8.A1(VDDQ) IC8.A8(VDDQ) IC8.B2(VDD) IC8.C1(VDDQ) IC8.C9(VDDQ) IC8.D2(VDDQ) IC8.D9(VDD) IC8.E9(VDDQ) IC8.F1(VDDQ) IC8.G7(VDD) IC8.H2(VDDQ) IC8.H9(VDDQ) IC8.K2(VDD) IC8.K8(VDD) IC8.N1(VDD) IC8.N9(VDD) IC8.R1(VDD) IC8.R9(VDD) IC9.2(VLDOIN) R128.1
P3V3: C172.2 IC9.7(EN) IC9.10(VIN) R127.2  [project net VCC]
VREF_DDR3: C162.2 C163.2 C177.2 IC8.H1(VREFDQ) IC8.M8(VREFCA) IC9.6(REFOUT)
VTT_DDR3: C173.2 C174.2 IC9.3(VO) IC9.5(VOSNS) R99.2 R100.2 R101.2 R102.2 R103.2 R104.2 R105.2 R106.2 R107.2 R108.2 R109.2 R110.2 R111.2 R112.2 R113.2 R114.2 R115.2 R116.2 R117.2 R118.2 R119.2 R120.1 R121.1
DDR3_A0: IC4#2.L6(IO_25_35) IC8.N3(A0) R119.1
DDR3_A1: IC4#2.M5(IO_L23N_T3_35) IC8.P7(A1) R118.1
DDR3_A2: IC4#2.P6(IO_L24P_T3_35) IC8.P3(A2) R117.1
DDR3_A3: IC4#2.K6(IO_L17P_T2_35) IC8.N2(A3) R116.1
DDR3_A4: IC4#2.M1(IO_L15P_T2_DQS_35) IC8.P8(A4) R115.1
DDR3_A5: IC4#2.M3(IO_L16P_T2_35) IC8.P2(A5) R114.1
DDR3_A6: IC4#2.N2(IO_L22N_T3_35) IC8.R8(A6) R113.1
DDR3_A7: IC4#2.M6(IO_L23P_T3_35) IC8.R2(A7) R112.1
DDR3_A8: IC4#2.P1(IO_L20N_T3_35) IC8.T8(A8) R111.1
DDR3_A9: IC4#2.P2(IO_L22P_T3_35) IC8.R3(A9) R110.1
DDR3_A10: IC4#2.L4(IO_L18N_T2_35) IC8.L7(A10/AP) R109.1
DDR3_A11: IC4#2.N5(IO_L24N_T3_35) IC8.R7(A11) R108.1
DDR3_A12: IC4#2.L3(IO_L14P_T2_SRCC_35) IC8.N7(A12/~{BC}) R107.1
DDR3_A13: IC4#2.R1(IO_L20P_T3_35) IC8.T3(A13) R106.1
DDR3_A14: IC4#2.N3(IO_L19N_T3_VREF_35) IC8.T7(A14) R105.1
DDR3_BA0: IC4#2.L5(IO_L18P_T2_35) IC8.M2(BA0) R101.1
DDR3_BA1: IC4#2.M2(IO_L16N_T2_35) IC8.N8(BA1) R100.1
DDR3_BA2: IC4#2.N4(IO_L19P_T3_35) IC8.M3(BA2) R99.1
DDR3_CAS_N: IC4#2.J6(IO_L17N_T2_35) IC8.K3(~{CAS}) R103.1
DDR3_CK_N: IC4#2.P4(IO_L21N_T3_DQS_35) IC8.K7(~{CK}) R121.2
DDR3_CK_P: IC4#2.P5(IO_L21P_T3_DQS_35) IC8.J7(CK) R120.2
DDR3_CKE: IC4#2.L1(IO_L15N_T2_DQS_35) IC8.K9(CKE) R122.2
DDR3_DQ0: IC4#2.G3(IO_L11N_T1_SRCC_35) IC8.E3(DQ0)
DDR3_DQ1: IC4#2.J1(IO_L7N_T1_AD6N_35) IC8.F7(DQ1)
DDR3_DQ2: IC4#2.H4(IO_L12P_T1_MRCC_35) IC8.F2(DQ2)
DDR3_DQ3: IC4#2.H5(IO_L10N_T1_AD15N_35) IC8.F8(DQ3)
DDR3_DQ4: IC4#2.H2(IO_L8P_T1_AD14P_35) IC8.H3(DQ4)
DDR3_DQ5: IC4#2.K1(IO_L7P_T1_AD6P_35) IC8.H8(DQ5)
DDR3_DQ6: IC4#2.H3(IO_L11P_T1_SRCC_35) IC8.G2(DQ6)
DDR3_DQ7: IC4#2.J5(IO_L10P_T1_AD15P_35) IC8.H7(DQ7)
DDR3_DQ8: IC4#2.G1(IO_L5P_T0_AD13P_35) IC8.D7(DQ8)
DDR3_DQ9: IC4#2.B1(IO_L1P_T0_AD4P_35) IC8.C3(DQ9)
DDR3_DQ10: IC4#2.F1(IO_L5N_T0_AD13N_35) IC8.C8(DQ10)
DDR3_DQ11: IC4#2.F3(IO_L6P_T0_35) IC8.C2(DQ11)
DDR3_DQ12: IC4#2.C2(IO_L2P_T0_AD12P_35) IC8.A7(DQ12)
DDR3_DQ13: IC4#2.A1(IO_L1N_T0_AD4N_35) IC8.A2(DQ13)
DDR3_DQ14: IC4#2.D2(IO_L4N_T0_35) IC8.B8(DQ14)
DDR3_DQ15: IC4#2.B2(IO_L2N_T0_AD12N_35) IC8.A3(DQ15)
DDR3_LDM: IC4#2.G2(IO_L8N_T1_AD14N_35) IC8.E7(LDM)
DDR3_LDQS_N: IC4#2.J2(IO_L9N_T1_DQS_AD7N_35) IC8.G3(~{LDQS})
DDR3_LDQS_P: IC4#2.K2(IO_L9P_T1_DQS_AD7P_35) IC8.F3(LDQS)
DDR3_ODT: IC4#2.K4(IO_L13P_T2_MRCC_35) IC8.K1(ODT) R126.2
DDR3_RAS_N: IC4#2.J4(IO_L13N_T2_MRCC_35) IC8.J3(~{RAS}) R104.1
DDR3_RESET_N: IC4#2.G4(IO_L12N_T1_MRCC_35) IC8.T2(~{RESET}) R123.2
DDR3_UDM: IC4#2.E2(IO_L4P_T0_35) IC8.D3(UDM)
DDR3_UDQS_N: IC4#2.D1(IO_L3N_T0_DQS_AD5N_35) IC8.B7(~{UDQS})
DDR3_UDQS_P: IC4#2.E1(IO_L3P_T0_DQS_AD5P_35) IC8.C7(UDQS)
DDR3_WE_N: IC4#2.K3(IO_L14N_T2_SRCC_35) IC8.L3(~{WE}) R102.1
NetC175_2: C175.2 IC9.1(REFIN) R128.2 R129.2
NetIC8_L2: IC8.L2(~{CS}) R124.2
NetIC8_L8: IC8.L8(ZQ) R125.2
NetIC9_9: IC9.9(PGOOD) R127.1

Not connected (* = marked no-connect by the designer): IC4#2 E3(IO_L6N_T0_VREF_35)* F4(IO_0_35)*; IC8 J1(NC)* J9(NC)* L1(NC)* L9(NC)* M7(NC)*

### Layout directives
differential pair: DDR3_CK_N, DDR3_CK_P, DDR3_LDQS_N, DDR3_LDQS_P, DDR3_UDQS_N, DDR3_UDQS_P
net class DDR_AddressAndControls; net class 50Ohm: DDR3_A0, DDR3_A1, DDR3_A2, DDR3_A3, DDR3_A4, DDR3_A5, DDR3_A6, DDR3_A7, DDR3_A8, DDR3_A9, DDR3_A10, DDR3_A11, DDR3_A12, DDR3_A13, DDR3_A14, DDR3_BA0, DDR3_BA1, DDR3_BA2, DDR3_CAS_N, DDR3_CK_N, DDR3_CK_P, DDR3_CKE, DDR3_ODT, DDR3_RAS_N, DDR3_WE_N
net class DDR_BL0; net class 50Ohm: DDR3_DQ0, DDR3_DQ1, DDR3_DQ2, DDR3_DQ3, DDR3_DQ4, DDR3_DQ5, DDR3_DQ6, DDR3_DQ7, DDR3_DQ8, DDR3_DQ9, DDR3_DQ10, DDR3_DQ11, DDR3_DQ12, DDR3_DQ13, DDR3_DQ14, DDR3_DQ15, DDR3_LDM, DDR3_LDQS_N, DDR3_LDQS_P, DDR3_UDM, DDR3_UDQS_N, DDR3_UDQS_P

### Notes on the sheet
- Termination resistors must be placed close to FPGA.
- Termination resistors must be placed close to DDR3 memory.
- (near R127) 0.75V
- (near C177) 0.75V
- (in symbol CMP-0364-00026-3, part F) BANK 35
- (in symbol R0402_5K1_1%_0.0625W_100PPM) 1%
- (in symbol R0402_10K_1%_0.0625W_100PPM) 1%
- (in symbol R0402_51R_1%_0.0625W_100PPM) 1%
- (in symbol R0402_240R_1%_0.0625W_100PPM) 1%

### Library data of the parts
C162-C171 C177 = CC0201_100NF_6.3V_10%_X5R: as C51 on sheet FPGAPower&Misc; Part Number: CC0201_100NF_6.3V_10%_X5R; Component Kind: Standard; Component Type: Standard; Pin Count: 2; Value: 100nF; Status: Not Recommended; Manufacturer Part Number: CC0201_100NF_6.3V_10%_X5R; Case: 0201; Mounted: Yes; Socket: No; SMD: Yes; Sense: No; Manufacturer1 Example: AVX; Manufacturer1 ComponentHeight: 0.33mm; HelpURL: \\cern.ch\dfs\Applications\Altium\Datasheets\CC0201_X5R_AVX.pdf; Author: CERN DEM JLC
  C162-C171: CreateDate: 2007-12-03; LatestRevisionDate: 2007-12-03
  C177: CreateDate: 03.12.2007; LatestRevisionDate: 03.12.2007
C172 = CC0402_1UF_16V_10%_X5R: Non-polarised capacitor; Part Description: SMD Multilayer Chip Ceramic Capacitor; Manufacturer: GENERIC; Manufacturer1 Part Number: C1005X5R1C105KT; Voltage: 16V; TC: X5R; Tolerance: ±10%; Part Number: CC0402_1UF_16V_10%_X5R; Component Kind: Standard; Component Type: Standard; Pin Count: 2; Value: 1uF; Status: Preferred; Manufacturer Part Number: CC0402_1UF_16V_10%_X5R; Case: 0402; Mounted: Yes; Socket: No; SMD: Yes; Manufacturer1 Example: TDK; Manufacturer1 ComponentHeight: 0.55mm; HelpURL: \\cern.ch\dfs\Applications\Altium\Datasheets\CC0402_X5R_TDK_C.pdf; Author: CERN DEM JLC; CreateDate: 25.10.2012; LatestRevisionDate: 25.10.2012; Sense: No
C173 C174 C176 = CC0603_22UF_6.3V_20%_X5R: as C50 on sheet FPGAPower&Misc; Part Number: CC0603_22UF_6.3V_20%_X5R; Component Kind: Standard; Component Type: Standard; Pin Count: 2; Value: 22uF; Status: None; Manufacturer Part Number: CC0603_22UF_6.3V_20%_X5R; Case: 0603; Mounted: Yes; Socket: No; SMD: Yes; Manufacturer1 Example: TDK; Manufacturer1 ComponentHeight: 1mm; HelpURL: \\cern.ch\dfs\Applications\Altium\Datasheets\CC0603_X5R_TDK_C.pdf; Author: CERN DEM JLC; CreateDate: 16.12.2013; LatestRevisionDate: 13.09.2016; Sense: No
C175 = CC0402_10NF_16V_10%_X7R: Non-polarised capacitor; Part Description: SMD Multilayer Chip Ceramic Capacitor; Manufacturer: GENERIC; Manufacturer1 Part Number: 223878715636; Voltage: 16V; TC: X7R; Tolerance: ±10%; Part Number: CC0402_10NF_16V_10%_X7R; Component Kind: Standard; Component Type: Standard; Pin Count: 2; Value: 10nF; Status: Not Recommended; Manufacturer Part Number: CC0402_10NF_16V_10%_X7R; Case: 0402; Mounted: Yes; Socket: No; SMD: Yes; Manufacturer1 Example: PHYCOMP; Manufacturer1 ComponentHeight: 0.55mm; HelpURL: \\cern.ch\dfs\Applications\Altium\Datasheets\CC0402_X7R_PHYCOMP.pdf; Author: CERN DEM JLC; CreateDate: 03.12.2007; LatestRevisionDate: 03.12.2007; Sense: No
IC4#2 = CMP-0364-00026-3: Artix-7 FPGA, 285 User I/Os, 4 GTP, 484-Ball BGA, Speed Grade 2, Commercial Grade, Pb-Free; Manufacturer: Xilinx; Max User I/O: 300; Clock Mgmt Tiles (CMTs): 6; Logic Cells: 101440; Block RAM Blocks (36Kb): 135; Block RAM Blocks (18Kb): 270; Speed Grade: -2; CLBs (Slices): 15850; Block RAM Blocks (Max Kb): 4860; DSP48E1 Slices: 240; RoHS: Pb-Free; ComponentLink3URL: http://www.xilinx.com/support/documentation/data_sheets/ds181_Artix_7_Data_Sheet.pdf; NexusDeviceID: XC7A100T-2FGG484C; DatasheetVersion: v1.12; Mounting Technology: Surface Mount; PackageDescription: Wire-Bond Fine-Pitch BGA, Body 23 x 23 mm, 1.0 mm Pitch; PackageReference: FGG484; ComponentLink2Description: Package Specification; Code_JEDEC: MS-034-AAJ-1; ComponentLink2URL: http://www.xilinx.com/support/documentation/user_guides/ug475_7Series_Pkg_Pinout.pdf; ComponentLink3Description: DC and Switching Characteristics; Generic Part Number: XC7A100T; ComponentLink4Description: Package File; ComponentLink4URL: http://www.xilinx.com/support/packagefiles/a7packages/xc7a100tfgg484pkg.txt; ComponentLink1URL: http://www.xilinx.com/support/documentation/data_sheets/ds180_7Series_Overview.pdf; PartNumber: XC7A100T-2FGG484C; ComponentLink5URL: http://www.xilinx.com/support/documentation/user_guides/ug475_7Series_Pkg_Pinout.pdf; PackageVersion: Rev 1.8; ComponentLink5Description: Packaging and Pinout; ComponentLink1Description: Datasheet; CLBs (Max Distributed RAM Kb): 1188; ClassName: Artix
IC8 = MT41K256M16TW-107:P: 32 Meg x 16 x 8 Banks DDR3L SDRAM; Part Description: +1.5V, 4Gb (32Meg x 16 x 8 banks) DDR3L SDRAM; Manufacturer: MICRON TECHNOLOGY; PressFit: No; Bonding: No; Part Number: MT41K256M16TW-107:P; Component Kind: Standard; Component Type: Standard; Device: MT41K256M16TW-107:P; PackageDescription: BGA 0.8mm, Pitch, Square 96 Pin, 9 Columns x 16 Rows, Body 14mm X 8mm X 1.2mm H; Manufacturer Part Number: MT41K256M16TW-107:P; Pin Count: 96; Case: BGA96; Mounted: Yes; Socket: No; SMD: Yes; Sense: No; ComponentHeight: 1.2mm; HelpURL: \\cern.ch\dfs\Applications\Altium\Datasheets\MT41K256M16TW-107-P.pdf; Author: CERN DEM MR; CreateDate: 2015-12-14; LatestRevisionDate: 2015-12-14
IC9 = TPS51200DRCT: Sink/Source DDR Termination Regulator; Part Description: 3.3V Sink/Source DDR Termination Regulator; Manufacturer: TEXAS INSTRUMENTS; PressFit: No; Bonding: No; Part Number: TPS51200DRCT; Component Kind: Standard; Component Type: Standard; Device: TPS51200DRCT; PackageDescription: SON, 0.50mm Pitch, 10-pin, 3.00mm W  X 3.00mm L X 1.00mm Height, (w/thermal tab 1.75 X 2.50 mm); Manufacturer Part Number: TPS51200DRCT; Pin Count: 11; Case: SON10; Mounted: Yes; Socket: No; SMD: Yes; Sense: No; ComponentHeight: 1mm; HelpURL: \\cern.ch\dfs\Applications\Altium\Datasheets\TPS51200DRCT.pdf; Author: CERN DEM JLC; CreateDate: 03.02.2010; LatestRevisionDate: 06.11.2013
R99-R121 R?#1-R?#22 = R0402_51R_1%_0.0625W_100PPM: Resistor - 1%; Part Description: General Purpose Thick Film Chip Resistor; Manufacturer: GENERIC; Manufacturer1 Part Number: 232270675109; TC: ±100ppm/°C; Table: Resistors SMD; Part Number: R0402_51R_1%_0.0625W_100PPM; Component Kind: Standard; Component Type: Standard; Pin Count: 2; Value: 51; Status: Not recommended; Power: 0.0625W; Tolerance: ±1%; Manufacturer Part Number: R0402_51R_1%_0.0625W_100PPM; Mounted: Yes; Socket: No; SMD: Yes; Manufacturer1 Example: PHYCOMP; Manufacturer1 ComponentHeight: 0.4mm; HelpURL: \\cern.ch\dfs\Applications\Altium\Datasheets\R0402_Phycomp_RC0402.pdf; Author: CERN DEM JLC; CreateDate: 03/12/2007; LatestRevisionDate: 13/03/2008
  R99-R118 R120 R121 R?#1-R?#21: Case: 0402
R122 R123 R126 = R0402_5K1_1%_0.0625W_100PPM: Resistor - 1%; Part Description: General Purpose Thick Film Chip Resistor; Manufacturer: GENERIC; Manufacturer1 Part Number: 232270675102L; TC: ±100ppm/°C; PressFit: No; Part Number: R0402_5K1_1%_0.0625W_100PPM; Component Kind: Standard; Component Type: Standard; Pin Count: 2; Value: 5k1; Status: Not Recommended; Power: 0.0625W; Tolerance: ±1%; Manufacturer Part Number: R0402_5K1_1%_0.0625W_100PPM; Case: 0402; Mounted: Yes; Sense: No; Socket: No; SMD: Yes; Manufacturer1 Example: YAGEO PHYCOMP; Manufacturer1 ComponentHeight: 0.4mm; HelpURL: \\cern.ch\dfs\Applications\Altium\Datasheets\R0402_Phycomp_RC0402.pdf; Author: CERN DEM JLC; CreateDate: 03.12.2007; LatestRevisionDate: 17.10.2012
R124 R125 = R0402_240R_1%_0.0625W_100PPM: Resistor - 1%; Part Description: General Purpose Thick Film Chip Resistor; Manufacturer: GENERIC; Manufacturer1 Part Number: 232270672401L; TC: ±100ppm/°C; PressFit: No; Part Number: R0402_240R_1%_0.0625W_100PPM; Component Kind: Standard; Component Type: Standard; Pin Count: 2; Value: 240; Status: Not Recommended; Power: 0.0625W; Tolerance: ±1%; Manufacturer Part Number: R0402_240R_1%_0.0625W_100PPM; Case: 0402; Mounted: Yes; Sense: No; Socket: No; SMD: Yes; Manufacturer1 Example: YAGEO PHYCOMP; Manufacturer1 ComponentHeight: 0.4mm; HelpURL: \\cern.ch\dfs\Applications\Altium\Datasheets\R0402_Phycomp_RC0402.pdf; Author: CERN DEM JLC; CreateDate: 03.12.2007; LatestRevisionDate: 17.10.2012
R127-R129 = R0402_10K_1%_0.0625W_100PPM: Resistor - 1%; Part Description: General Purpose Thick Film Chip Resistor; Manufacturer: GENERIC; Manufacturer1 Part Number: 232270671003L; TC: ±100ppm/°C; PressFit: No; Part Number: R0402_10K_1%_0.0625W_100PPM; Component Kind: Standard; Component Type: Standard; Pin Count: 2; Value: 10k; Status: Not Recommended; Power: 0.0625W; Tolerance: ±1%; Manufacturer Part Number: R0402_10K_1%_0.0625W_100PPM; Case: 0402; Mounted: Yes; Socket: No; SMD: Yes; Manufacturer1 Example: YAGEO PHYCOMP; Manufacturer1 ComponentHeight: 0.4mm; HelpURL: \\cern.ch\dfs\Applications\Altium\Datasheets\R0402_Phycomp_RC0402.pdf; Author: CERN DEM JLC; CreateDate: 03.12.2007; LatestRevisionDate: 17.10.2012; Sense: No

## Sheet adc.schdoc: SoRad: Analog to Digital Conversion
size A3; Author: Chris Hiszpanski
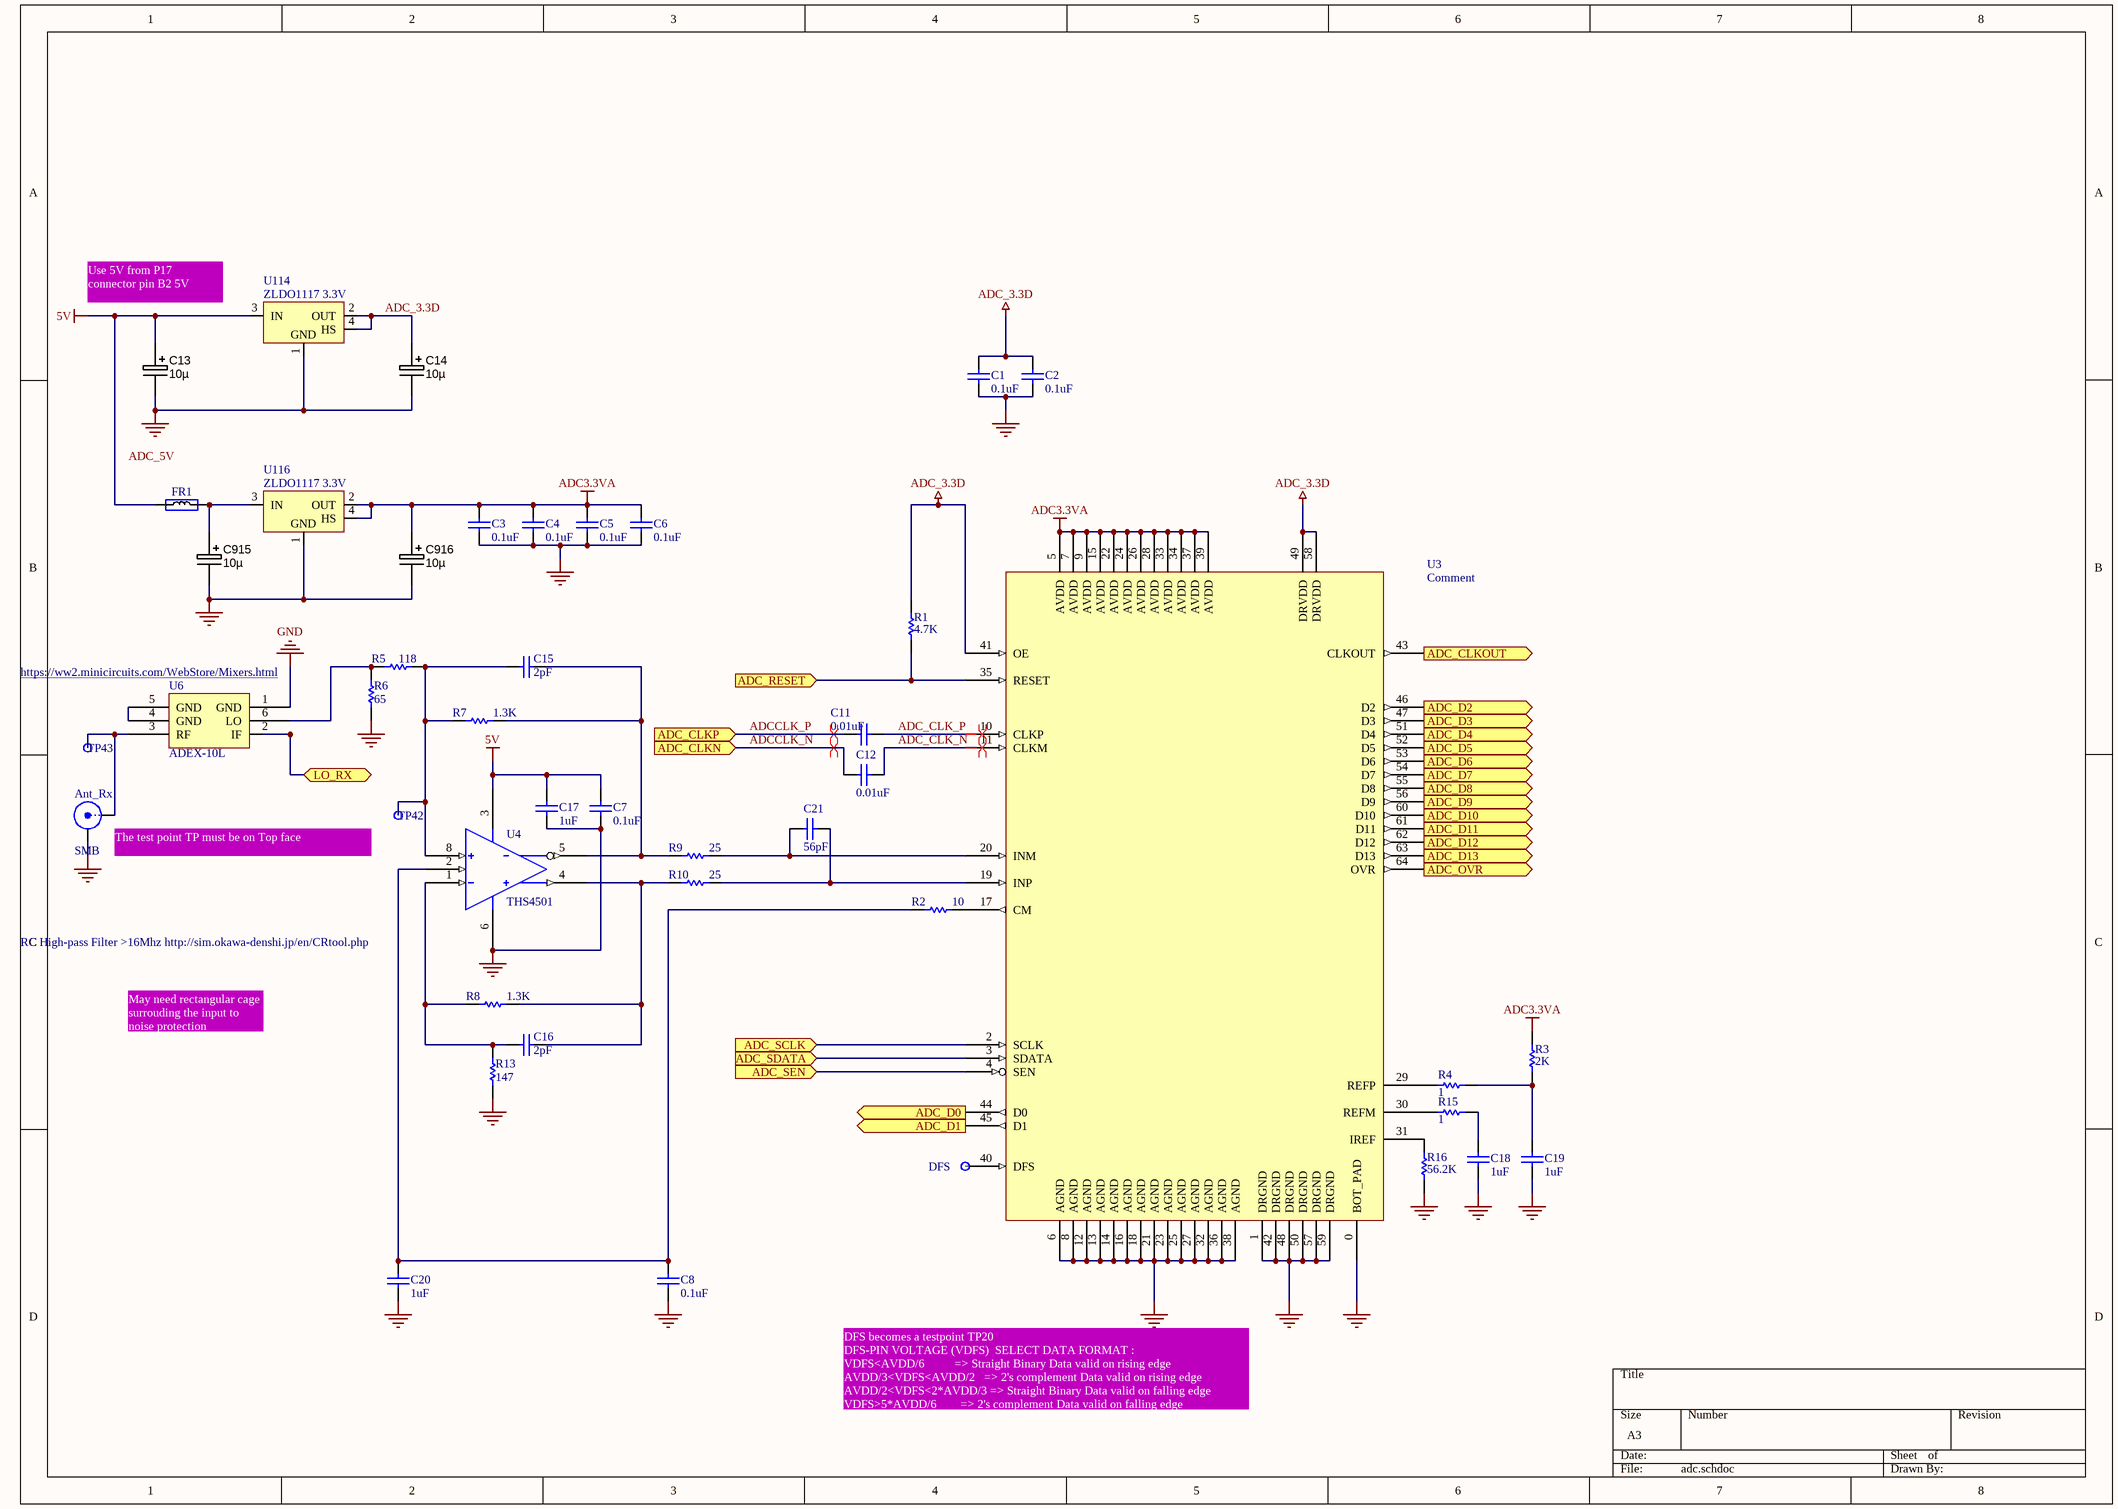
[diagram p5: adc.schdoc]

### Parts
(Parts that share a designator on the sheet are numbered #1, #2 ... from top to bottom, then left to right.)
Ant_Rx  SMB  [SMB_V-RJ45]
C1  0.1uF  [CAPC1005X55N]
C2  0.1uF  [CAPC1005X55N]
C3  0.1uF  [CAPC1005X55N]
C4  0.1uF  [CAPC1005X55N]
C5  0.1uF  [CAPC1005X55N]
C6  0.1uF  [CAPC1005X55N]
C7  0.1uF  [CAPC1005X55N]
C8  0.1uF  [CAPC1005X55N]
C11  0.01uF  [CAPC1005X55N]
C12  0.01uF  [CAPC1005X55N]
C13  value 10µ  [CAPMP6032X280N]  (hidden comment: approved sub OK)
C14  value 10µ  [CAPMP6032X280N]  (hidden comment: approved sub OK)
C15  2pF  [CAPC1005X55N]
C16  2pF  [CAPC1005X55N]
C17  1uF  [CAPC1005X55N]
C18  1uF  [CAPC1005X55N]
C19  1uF  [CAPC1005X55N]
C20  1uF  [CAPC1005X55N]
C21  56pF  [CAPC1005X55N]
C915  value 10µ  [CAPMP6032X280N]  (hidden comment: approved sub OK)
C916  value 10µ  [CAPMP6032X280N]  (hidden comment: approved sub OK)
DFS  P2V5  [TPS127]  (value not drawn)
FR1  Ferrite  [C0603]  (value not drawn)
R1  4.7K  [RESC1005N]
R2  10  [RESC1005N]
R3  2K  [RESC1005N]
R4  1  [RESC1005N]
R5  118  [RESC1005N]
R6  65  [RESC1005N]
R7  1.3K  [RESC1005N]
R8  1.3K  [RESC1005N]
R9  25  [RESC1005N]
R10  25  [RESC1005N]
R13  147  [RESC1005N]
R15  1  [RESC1005N]
R16  56.2K  [RESC1005N]
TP42#1  LO_RX  [TPS127]  (value not drawn)
TP43  LO_RX  [TPS127]  (value not drawn)
U3  Comment  [HQFP64]
U4  THS4501  [SOIC8]
U6  ADEX-10L
U114  ZLDO1117 3.3V  [SOT223]
U116  ZLDO1117 3.3V  [SOT223]

### Ports
ADC_CLKN (in), ADC_CLKOUT (out), ADC_CLKP (in), ADC_D0 (out), ADC_D1 (out), ADC_D2 (out), ADC_D3 (out), ADC_D4 (out), ADC_D5 (out), ADC_D6 (out), ADC_D7 (out), ADC_D8 (out), ADC_D9 (out), ADC_D10 (out), ADC_D11 (out), ADC_D12 (out), ADC_D13 (out), ADC_OVR (out), ADC_RESET (in), ADC_SCLK (in), ADC_SDATA (in), ADC_SEN (in), LO_RX

### Nets
5V: C7.2 C13.1 C17.2 FR1.1 U4.3(Vs+) U114.3(IN)
ADC3.3VA: C3.2 C4.2 C5.2 C6.2 C916.1 R3.1 U3.5(AVDD) U3.7(AVDD) U3.9(AVDD) U3.15(AVDD) U3.22(AVDD) U3.24(AVDD) U3.26(AVDD) U3.28(AVDD) U3.33(AVDD) U3.34(AVDD) U3.37(AVDD) U3.39(AVDD) U116.2(OUT) U116.4(HS)
ADC_3.3D: C1.2 C2.2 C14.1 R1.2 U3.41(OE) U3.49(DRVDD) U3.58(DRVDD) U114.2(OUT) U114.4(HS)
GND: Ant_Rx.2(Y) C1.1 C2.1 C3.1 C4.1 C5.1 C6.1 C7.1 C8.1 C13.2 C14.2 C17.1 C18.1 C19.1 C20.1 C915.2 C916.2 R6.2 R13.2 R16.2 U3.0(BOT_PAD) U3.1(DRGND) U3.6(AGND) U3.8(AGND) U3.12(AGND) U3.13(AGND) U3.14(AGND) U3.16(AGND) U3.18(AGND) U3.21(AGND) U3.23(AGND) U3.25(AGND) U3.27(AGND) U3.32(AGND) U3.36(AGND) U3.38(AGND) U3.42(DRGND) U3.48(DRGND) U3.50(DRGND) U3.57(DRGND) U3.59(DRGND) U4.6(Vs-) U6.1(GND) U114.1(GND) U116.1(GND)  [project net DXN_0]
ADC_CLK_N: C12.2 U3.11(CLKM)
ADC_CLK_P: C11.1 U3.10(CLKP)
ADC_CLKOUT: U3.43(CLKOUT) ; port ADC_CLKOUT
ADC_D0: U3.44(D0) ; port ADC_D0
ADC_D1: U3.45(D1) ; port ADC_D1
ADC_D2: U3.46(D2) ; port ADC_D2
ADC_D3: U3.47(D3) ; port ADC_D3
ADC_D4: U3.51(D4) ; port ADC_D4
ADC_D5: U3.52(D5) ; port ADC_D5
ADC_D6: U3.53(D6) ; port ADC_D6
ADC_D7: U3.54(D7) ; port ADC_D7
ADC_D8: U3.55(D8) ; port ADC_D8
ADC_D9: U3.56(D9) ; port ADC_D9
ADC_D10: U3.60(D10) ; port ADC_D10
ADC_D11: U3.61(D11) ; port ADC_D11
ADC_OVR: U3.64(OVR) ; port ADC_OVR
ADC_RESET: R1.1 U3.35(RESET) ; port ADC_RESET
ADC_SCLK: U3.2(SCLK) ; port ADC_SCLK
ADC_SDATA: U3.3(SDATA) ; port ADC_SDATA
ADC_SEN: U3.4(SEN) ; port ADC_SEN
ADCCLK_N: C12.1 ; port ADC_CLKN  [project net ADC_CLKN]
ADCCLK_P: C11.2 ; port ADC_CLKP  [project net ADC_CLKP]
NetAnt_Rx_1: Ant_Rx.1(X) TP43.1 U6.3(RF)
NetC8_2: C8.2 C20.2 R2.2 U4.2(Vocm)
NetC15_1: C15.1 R7.1 R9.2 U4.5(Vout-)
NetC15_2: C15.2 R5.1 R7.2 TP42#1.1 U4.8(Vin+)
NetC16_1: C16.1 R8.1 R10.2 U4.4(Vout+)
NetC16_2: C16.2 R8.2 R13.1 U4.1(Vin-)
NetC18_2: C18.2 R15.2
NetC19_2: C19.2 R3.2 R4.2
NetC21_1: C21.1 R9.1 U3.20(INM)
NetC21_2: C21.2 R10.1 U3.19(INP)
NetC915_1: C915.1 FR1.2 U116.3(IN)
NetDFS_1: DFS.1 U3.40(DFS)
NetR2_1: R2.1 U3.17(CM)
NetR4_1: R4.1 U3.29(REFP)
NetR5_2: R5.2 R6.1 U6.6(LO)
NetR15_1: R15.1 U3.30(REFM)
NetR16_1: R16.1 U3.31(IREF)
NetU3_62: U3.62(D12) ; port ADC_D12
NetU3_63: U3.63(D13) ; port ADC_D13
NetU6_2: U6.2(IF) ; port LO_RX
NetU6_4: U6.4(GND) U6.5(GND)

### Layout directives
differential pair: ADC_CLK_N, ADC_CLK_P, ADC_CLKN, ADC_CLKP

### Notes on the sheet
- Use 5V from P17 connector pin B2 5V
- (near U6) https://ww2.minicircuits.com/WebStore/Mixers.html
- (near Ant_Rx) The test point TP must be on Top face
- (near U4) RC High-pass Filter >16Mhz http://sim.okawa-denshi.jp/en/CRtool.php
- May need rectangular cage surrouding the input to noise protection
- DFS becomes a testpoint TP20
  DFS-PIN VOLTAGE (VDFS)  SELECT DATA FORMAT :
  VDFS<AVDD/6          => Straight Binary Data valid on rising edge
  AVDD/3<VDFS<AVDD/2   => 2's complement Data valid on rising edge
  AVDD/2<VDFS<2*AVDD/3 => Straight Binary Data valid on falling edge
  VDFS>5*AVDD/6        => 2's complement Data valid on falling edge
- Labels drawn without touching a wire or pin: ADC_5V

### Library data of the parts
Ant_Rx = SMB: SMB Straight Connector; LatestRevisionDate: 17-Jul-2002; LatestRevisionNote: Re-released for DXP Platform.; Publisher: Altium Limited
C1-C8 = Cap: Capacitor; Manufacturer: Panasonic; Manufacturer Part Number: ECJ-2VF1C104Z; Published: 8-Jun-2000; Revision: July-2002: Re-released for DXP Platform.; Publisher: Altium Limited; Value: 0.1uF; Distributor: Digikey; Distributor Part Number: PCC1843CT-ND
C11 C12 = Cap: Capacitor; Manufacturer: Panasonic; Manufacturer Part Number: ECJ-2VF1H103Z; Published: 8-Jun-2000; Revision: July-2002: Re-released for DXP Platform.; Publisher: Altium Limited; Value: 0.01uF; Distributor: Digikey; Distributor Part Number: PCC1858CT-ND
C13 C14 C915 C916 = CAPT_10u_6032_16V: Capacitor SMD Tantalum 10uF 20% 16V EIA 6032-28; Manufacturer 1: Vishay/Sprague; Manufacturer Part Number 1: 293D106X0016C2TE3; SCDType: undef; Package / Case: EIA 6032-28; Tolerance: ±20%; Ratings: 16V; Material: Tantalum; Supplier 1: Digi-Key; Supplier Part Number 1: 718-1042-1-ND
C15 C16 = Cap: Capacitor; Manufacturer: Cornell Dubilier; Manufacturer Part Number: MC08CA020D-F; Published: 8-Jun-2000; Revision: July-2002: Re-released for DXP Platform.; Publisher: Altium Limited; Value: 2pF; Distributor: Digikey; Distributor Part Number: 338-1096-ND
C17-C20 = Cap: Capacitor; Manufacturer: Panasonic; Manufacturer Part Number: ECJ-2VF1C105Z; Published: 8-Jun-2000; Revision: July-2002: Re-released for DXP Platform.; Publisher: Altium Limited; Value: 1uF; Distributor: Digikey; Distributor Part Number: PCC1849CT-ND
C21 = Cap: Capacitor; Manufacturer: Yageo; Manufacturer Part Number: CC0805JRNP09BN560; Published: 8-Jun-2000; Revision: July-2002: Re-released for DXP Platform.; Publisher: Altium Limited; Value: 56pF; Distributor: Digikey; Distributor Part Number: 311-1108-1-ND
DFS TP42#1 TP43 = SMD_PAD_1.27X1.27MM: Test Point; Part Description: 1.27mm x 1.27mm PCB Copper Area (SMD Test Point); Mounted: No; Part Number: SMD_PAD_1.27X1.27MM; Component Kind: Standard (No BOM); Component Type: Standard (No BOM); Pin Count: 1; Family: Test Point; Socket: No; SMD: Yes; Sense: No; Status: None; ComponentHeight: 0mm; HelpURL: Undefined; Author: CERN DEM JLC; CreateDate: 12.01.2008; LatestRevisionDate: 12.01.2008; PackageDescription: 1.27mm x 1.27mm PCB Copper Area (SMD Test Point)
FR1 = Ferrite: Manufacturer Part Number 1: BK0603TS601-T; Manufacturer: Taiyo Yuden; Part Description: FERRITE BEAD 600 OHM 0201 1LN; DC Resistance (DCR): 750 mOhm Max; Filter Type: Differential Mode - Single; Impedance @ Frequency: 600 Ohm @ 100MHz; Current Rating: 270mA; Value: 600R@100MHz; Supplier 1: Digi-Key; Supplier Part Number 1: 587-3277-1-ND; Size / Dimension: 0.024" L x 0.012" W (0.60mm x 0.30mm); Package / Case: 0201 (0603 Metric); Height (Max): 0.013" (0.33mm); Mounting Type: Surface Mount; Packaging: Cut Tape (CT); RoHS: RoHS Compliant; Category: Filters
R1 = Res1: Resistor; Manufacturer: Generic Components; Manufacturer: Vishay/Dale; Manufacturer Part Number: CRCW08054K70JNEA; Class I: Passive; Published: 8-Jun-2000; Revision: July-2002: Re-released for DXP Platform.; Publisher: Altium Limited; Class II: Resistor; Value: 4.7K; Distributor: Digikey; Distributor Part Number: 541-4.7KACT-ND
R2 = Res1: Resistor; Manufacturer: Yageo; Manufacturer Part Number: RC0805FR-0710RL; Published: 8-Jun-2000; Revision: July-2002: Re-released for DXP Platform.; Publisher: Altium Limited; Value: 10; Distributor: Digikey; Distributor Part Number: 311-10.0CRCT-ND
R3 = Res1: Resistor; Manufacturer: Yageo; Manufacturer Part Number: RC0805FR-072KL; Published: 8-Jun-2000; Revision: July-2002: Re-released for DXP Platform.; Publisher: Altium Limited; Value: 2K; Distributor: Digikey; Distributor Part Number: 311-2.00KCRCT-ND
R4 R15 = Res1: Resistor; Manufacturer: Yageo; Manufacturer Part Number: RC0805FR-071RL; Published: 8-Jun-2000; Revision: July-2002: Re-released for DXP Platform.; Publisher: Altium Limited; Value: 1; Distributor: Digikey; Distributor Part Number: 311-1.00CRCT-ND
R5 = Res1: Resistor; Manufacturer: Yageo; Manufacturer Part Number: 9C08052A1180FKHFT; Published: 8-Jun-2000; Revision: July-2002: Re-released for DXP Platform.; Publisher: Altium Limited; Value: 118; Distributor: Digikey; Distributor Part Number: 311-118CCT-ND
R6 = Res1: Resistor; Manufacturer: Yageo; Manufacturer Part Number: 9C08052A64R9FKHFT; Published: 8-Jun-2000; Revision: July-2002: Re-released for DXP Platform.; Publisher: Altium Limited; Value: 65; Distributor: Digikey; Distributor Part Number: 311-64.9CCT-ND
R7 R8 = Res1: Resistor; Manufacturer: Rohm; Manufacturer Part Number: MCR10EZHF1301; Published: 8-Jun-2000; Revision: July-2002: Re-released for DXP Platform.; Publisher: Altium Limited; Value: 1.3K; Distributor: Digikey; Distributor Part Number: RHM1.30KCCT-ND
R9 R10 = Res1: Resistor; Manufacturer: Vishay/Dale; Manufacturer Part Number: CRCW080524R9FKEA; Published: 8-Jun-2000; Revision: July-2002: Re-released for DXP Platform.; Publisher: Altium Limited; Value: 25; Distributor: Digikey; Distributor Part Number: 541-24.9CCT-ND
R13 = Res1: Resistor; Manufacturer: Yageo; Manufacturer Part Number: RC0805FR-07147RL; Published: 8-Jun-2000; Revision: July-2002: Re-released for DXP Platform.; Publisher: Altium Limited; Value: 147; Distributor: Digikey; Distributor Part Number: 311-147CRCT-ND
R16 = Res1: Resistor; Manufacturer: Yageo; Manufacturer Part Number: RC0805FR-0756K2L; Published: 8-Jun-2000; Revision: July-2002: Re-released for DXP Platform.; Publisher: Altium Limited; Value: 56.2K; Distributor: Digikey; Distributor Part Number: 311-56.2KCRCT-ND
U3 = ADS5520: ADC 12BIT 125MSPS; Manufacturer: Texas Instruments; Manufacturer Part Number: ADS5520IPAP; Distributor: Digikey; Distributor Part Number: 296-17702-ND
U4 = THS4501: Differential Amplifier; Manufacturer: Texas Instruments; Manufacturer Part Number: THS4501ID; Distributor: Digikey; Distributor Part Number: 296-12936-5-ND
U6 = ADEX-10L: Passive Mixer
U114 = LM1117: Power
U116 = LM1117: Power; comment_1: LM1117MPX-3.3/NOPB